# EAGLE schematic Boczek_schm_pls_check (EAGLE 9.6.2)
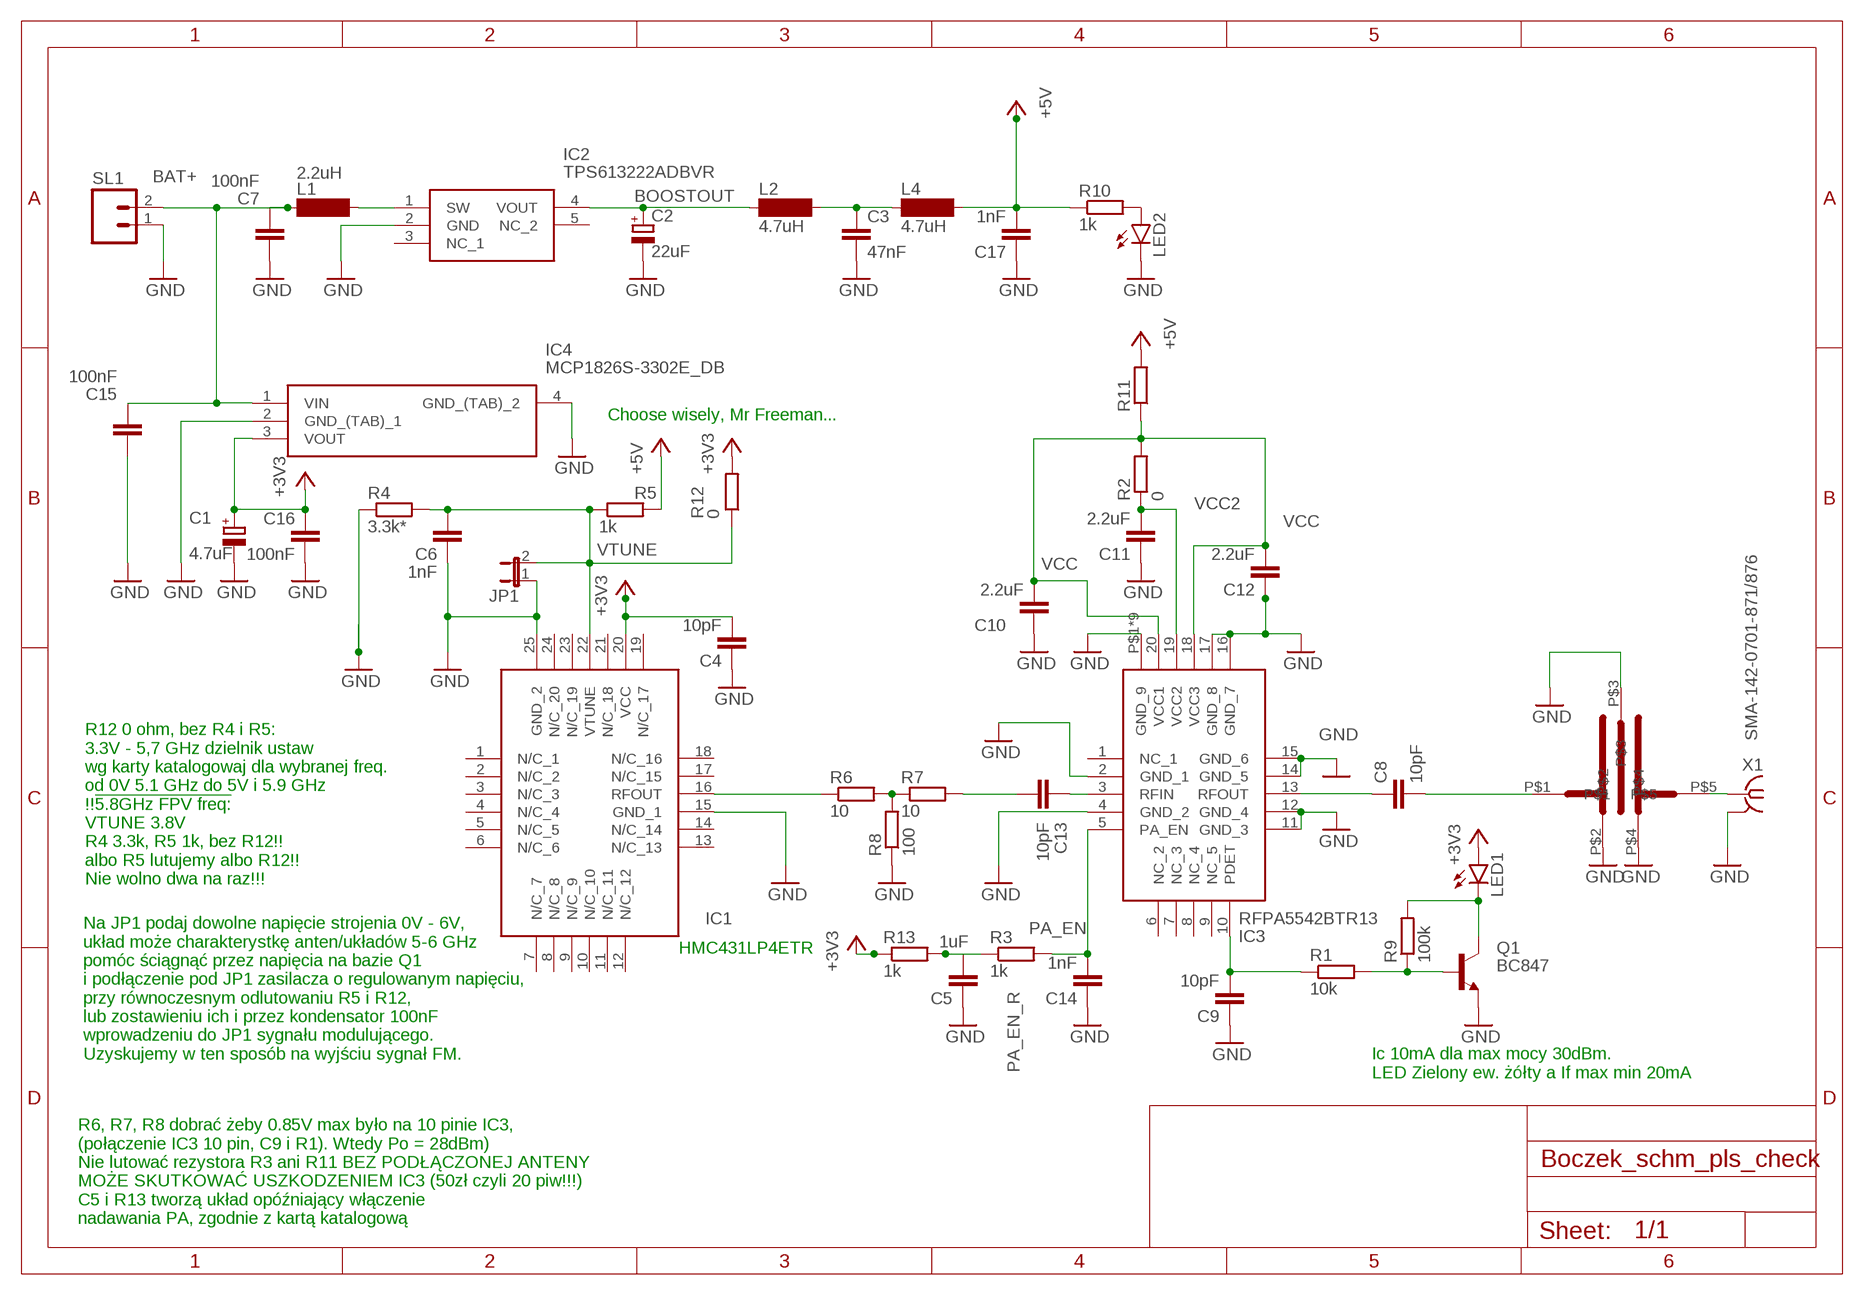
[diagram p0: schematic, sheet 1]

## Parts
C1  4.7uF  CPOL-EUSMCE  [SMC_E]
C2  22uF  CPOL-EUSMCE  [SMC_E]
C3  47nF  C-EUC1206  [C1206]
C4  10pF  C-EUC0603  [C0603]
C5  1uF  C-EUC1206  [C1206]
C6  1nF  C-EUC0402  [C0402]
C7  100nF  C-EUC1206  [C1206]
C8  10pF  C-EUC0402  [C0402]
C9  10pF  C-EUC0402  [C0402]
C10  2.2uF  C-EUC0402  [C0402]
C11  2.2uF  C-EUC0402  [C0402]
C12  2.2uF  C-EUC0402  [C0402]
C13  10pF  C-EUC0402  [C0402]
C14  1nF  C-EUC0402  [C0402]
C15  100nF  C-EUC1206  [C1206]
C16  100nF  C-EUC1206  [C1206]
C17  1nF  C-EUC0402  [C0402]
IC1  HMC430LP4ETR  [QFN50P400X400X100-25N]
IC2  TPS613222ADBVR  [SOT95P280X145-5N]
IC3  RFPA5542BTR13  [QFN50P400X400X85-21N]
IC4  MCP1826S-3302E_DB  [SOT230P700X180-4N]
JP1  JP1E  [JP1]
L1  2.2uH  SM-NE45  [SM-NE45]
L2  4.7uH  SM-NE45  [SM-NE45]
L4  4.7uH  SM-NE45  [SM-NE45]
LED1  LEDSMT1206  [1206]
LED2  LEDSMT1206  [1206]
Q1  BC847  [SOT23]
R1  10k  R-EU_R0603  [R0603]
R2  0  R-EU_R0603  [R0603]
R3  1k  R-EU_R0603  [R0603]
R4  3.3k*  R-EU_R0603  [R0603]
R5  1k  R-EU_R0603  [R0603]
R6  10  R-EU_R0603  [R0603]
R7  10  R-EU_R0603  [R0603]
R8  100  R-EU_R0603  [R0603]
R9  100k  R-EU_R0603  [R0603]
R10  1k  R-EU_R0603  [R0603]
R11  0  R-EU_R0603  [R0603]
R12  0  R-EU_R0603  [R0603]
R13  1k  R-EU_R0603  [R0603]
SL1  M02  [02P]
U$1  INTERDIGITAL_FILTER_3RD_ORDER  [JLC7628_5000_6000_3RDORDER_FILTER]
X1  SMA-142-0701-871/876  [J502-ND-142-0701-871/876]

## Nets
+3V3: C1.+ C4.2 C16.2 IC1.20(VCC) IC4.3(VOUT) LED1.A R12.2 R13.1
+5V: C17.2 L4.2 R5.2 R10.1 R11.2
BAT+: C7.2 C15.2 IC4.1(VIN) L1.1 SL1.2
BOOSTOUT: C2.+ IC2.4(VOUT) L2.1
GND [Gnd]: C1.- C2.- C3.2 C4.1 C5.1 C6.1 C7.1 C9.1 C10.1 C11.1 C12.1 C14.1 C15.1 C16.1 C17.1 IC1.15(GND_1) IC1.25(GND_2) IC2.2(GND) IC3.2(GND_1) IC3.4(GND_2) IC3.11(GND_3) IC3.12(GND_4) IC3.14(GND_5) IC3.15(GND_6) IC3.16(GND_7) IC3.17(GND_8) IC3.P$1(GND_9) IC3.P$2(GND_9) IC3.P$3(GND_9) IC3.P$4(GND_9) IC3.P$5(GND_9) IC3.P$6(GND_9) IC3.P$7(GND_9) IC3.P$8(GND_9) IC3.P$9(GND_9) IC4.2(GND_(TAB)_1) IC4.4(GND_(TAB)_2) JP1.1 LED2.C Q1.2(E) R4.1 R8.1 SL1.1 U$1.P$2 U$1.P$3 U$1.P$4 X1.G@1 X1.G@2 X1.G@3 X1.G@4
N$1: U$1.P$5 X1.1
N$2: IC1.16(RFOUT) R6.1
N$3: R6.2 R7.1 R8.2
N$4: C13.1 IC3.3(RFIN)
N$5: LED2.A R10.2
N$6: C8.2 U$1.P$1
N$7: IC2.1(SW) L1.2
N$8: C13.2 R7.2
N$13: C9.2 IC3.10(PDET) R1.1
N$14: LED1.C Q1.3(C) R9.2
N$15: C3.1 L2.2 L4.1
N$16: Q1.1(B) R1.2 R9.1
N$17: C8.1 IC3.13(RFOUT)
PA_EN: C14.2 IC3.5(PA_EN) R3.2
PA_EN_R: C5.2 R3.1 R13.2
VCC: C10.2 C12.2 IC3.18(VCC3) IC3.20(VCC1) R2.2 R11.1
VCC2: C11.2 IC3.19(VCC2) R2.1
VTUNE: C6.2 IC1.22(VTUNE) JP1.2 R4.2 R5.1 R12.1
Unconnected: IC1.1(N/C_1) IC1.2(N/C_2) IC1.3(N/C_3) IC1.4(N/C_4) IC1.5(N/C_5) IC1.6(N/C_6) IC1.7(N/C_7) IC1.8(N/C_8) IC1.9(N/C_9) IC1.10(N/C_10) IC1.11(N/C_11) IC1.12(N/C_12) IC1.13(N/C_13) IC1.14(N/C_14) IC1.17(N/C_15) IC1.18(N/C_16) IC1.19(N/C_17) IC1.21(N/C_18) IC1.23(N/C_19) IC1.24(N/C_20) IC2.3(NC_1) IC2.5(NC_2) IC3.1(NC_1) IC3.6(NC_2) IC3.7(NC_3) IC3.8(NC_4) IC3.9(NC_5)

## Notes on the sheet
- Choose wisely, Mr Freeman...
- R12 0 ohm, bez R4 i R5:
  3.3V - 5,7 GHz dzielnik ustaw
  wg karty katalogowaj dla wybranej freq.
  od 0V 5.1 GHz do 5V i 5.9 GHz 
  !!!5.8GHz FPV freq:
  VTUNE 3.8V
  R4 3.3k, R5 1k, bez R12!!
  albo R5 lutujemy albo R12!!
  Nie wolno dwa na raz!!!
- HMC431LP4ETR
- Na JP1 podaj dowolne napięcie strojenia 0V - 6V,
  układ może charakterystkę anten/układów 5-6 GHz 
  pomóc ściągnąć przez napięcia na bazie Q1
  i podłączenie pod JP1 zasilacza o regulowanym napięciu,
  przy równoczesnym odlutowaniu R5 i R12,
  lub zostawieniu ich i przez kondensator 100nF
  wprowadzeniu do JP1 sygnału modulującego.
  Uzyskujemy w ten sposób na wyjściu sygnał FM.
- Ic 10mA dla max mocy 30dBm.
  LED Zielony ew. żółty a If max min 20mA
- R6, R7, R8 dobrać żeby 0.85V max było na 10 pinie IC3,
  (połączenie IC3 10 pin, C9 i R1). Wtedy Po = 28dBm)
  Nie lutować rezystora R3 ani R11 BEZ PODŁĄCZONEJ ANTENY
  MOŻE SKUTKOWAĆ USZKODZENIEM IC3 (50zł czyli 20 piw!!!)
  C5 i R13 tworzą układ opóźniający włączenie
  nadawania PA, zgodnie z kartą katalogową

## Library data of the parts
C1 C2 = rcl:CPOL-EU: POLARIZED CAPACITOR, European symbol; SPICEPREFIX: C
C3-C17 = rcl:C-EU: CAPACITOR, European symbol; SPICEPREFIX: C
IC1 = SamacSys_Parts:HMC430LP4ETR: VCO Oscillators VCO SMT w/Buffer amp, 5.0 - 5.5 GHz Source: Datasheet <https://www.analog.com/media/en/technical-documentation/data-sheets/hmc430.pdf>; DESCRIPTION: VCO Oscillators VCO SMT w/Buffer amp, 5.0 - 5.5 GHz; HEIGHT: 1mm; MANUFACTURER_NAME: Analog Devices; MANUFACTURER_PART_NUMBER: HMC431LP4ETR; MOUSER_PART_NUMBER: 584-HMC430LP4ETR; MOUSER_PRICE-STOCK: https://www.mouser.co.uk/ProductDetail/Analog-Devices/HMC430LP4ETR?qs=pceeu5JH%2FH8gg6v6ve1tvQ%3D%3D
IC2 = SamacSys_Parts:TPS613222ADBVR: 6-uA Quiescent Current, 1.8-A Switch Current Boost Converter Source: Datasheet <http://www.ti.com/lit/gpn/tps61322>; DESCRIPTION: 6-uA Quiescent Current, 1.8-A Switch Current Boost Converter; HEIGHT: 1.45mm; MANUFACTURER_NAME: Texas Instruments; MANUFACTURER_PART_NUMBER: TPS613222ADBVR; MOUSER_PART_NUMBER: 595-TPS613222ADBVR; MOUSER_PRICE-STOCK: https://www.mouser.co.uk/ProductDetail/Texas-Instruments/TPS613222ADBVR?qs=W0yvOO0ixfE4d69WXsn8NQ%3D%3D
IC3 = SamacSys_Parts:RFPA5542BTR13: RF Amplifier 5GHZ Discrete PA Source: Datasheet <https://www.mouser.pl/datasheet/2/412/RFPA5542 Data Sheet-1314453.pdf>; DESCRIPTION: RF Amplifier 5GHZ Discrete PA; HEIGHT: 0.85mm; MANUFACTURER_NAME: Qorvo; MANUFACTURER_PART_NUMBER: RFPA5542BTR13; MOUSER_PART_NUMBER: 772-RFPA5542BTR13; MOUSER_PRICE-STOCK: https://www.mouser.co.uk/ProductDetail/Qorvo/RFPA5542BTR13?qs=u4fy%2FsgLU9OIcUWfOD%252Bf6g%3D%3D
IC4 = SamacSys_Parts:MCP1826S-3302E_DB: LDO Regulator 1A 3.3V SOT223-3 MCP1826S-3302E/DB, Low Dropout Voltage Regulator, 1A, 3.3 V +/-2%, 2.3 6 Vin, 4-Pin SOT-223 Source: Datasheet <http://ww1.microchip.com/downloads/en/DeviceDoc/22057B.pdf>; DESCRIPTION: LDO Regulator 1A 3.3V SOT223-3 MCP1826S-3302E/DB, Low Dropout Voltage Regulator, 1A, 3.3 V +/-2%, 2.3 6 Vin, 4-Pin SOT-223; HEIGHT: 1.8mm; MANUFACTURER_NAME: Microchip; MANUFACTURER_PART_NUMBER: MCP1826S-3302E/DB; MOUSER_PART_NUMBER: 579-MCP1826S-3302EDB; MOUSER_PRICE-STOCK: https://www.mouser.co.uk/ProductDetail/Microchip-Technology-Atmel/MCP1826S-3302E-DB?qs=gsqZ4L1luKqjUo%2Fe%2Fgllfg%3D%3D
JP1 = jumper:JP1E: JUMPER
L1 L4 = inductor-neosid:SM-NE45: INDUCTOR SMD chip inductor; OC_FARNELL: unknown; OC_NEWARK: unknown
L2 = inductor-neosid:SM-NE45: INDUCTOR SMD chip inductor; OC_FARNELL: unknown; OC_NEWARK: unknown; SPICEPREFIX: L
LED1 LED2 = led:LED: LED OSRAM: - CHIPLED LG R971, LG N971, LY N971, LG Q971, LY Q971, LO R971, LY R971 LH N974, LH R974 LS Q976, LO Q976, LY Q976 LO Q996 - Hyper CHIPLED LW Q18S LB Q993, LB Q99A, LB R99A - SideLED LS A670, LO A670, LY A670, LG A670, LP A670 LB A673, LV A673, LT A673, LW A673 LH A674 LY A675 LS A676, LA A676, LO A676, LY A676, LW A676 LS A679, LY A679, LG A679 - Hyper Micro SIDELED® LS Y876, LA Y876, LO Y876, LY Y876 LT Y87S - SmartLED LW L88C, LW L88S LB L89C, LB L89S, LG L890 LS L89K, LO L89K, LY L89K LS L896, LA L896, LO L896, LY L896 - TOPLED LS T670, LO T670, LY T670, LG T670, LP T670 LSG T670, LSP T670, LSY T670, LOP T670, LYG T670 LG T671, LOG T671, LSG T671 LB T673, LV T673, LT T673, LW T673 LH T674 LS T676, LA T676, LO T676, LY T676, LB T676, LH T676, LSB T676, LW T676 LB T67C, LV T67C, LT T67C, LS T67K, LO T67K, LY T67K, LW E67C LS E67B, LA E67B, LO E67B, LY E67B, LB E67C, LV E67C, LT E67C LW T67C LS T679, LY T679, LG T679 LS T770, LO T770, LY T770, LG T770, LP T770 LB T773, LV T773, LT T773, LW T773 LH T774 LS E675, LA E675, LY E675, LS T675 LS T776, LA T776, LO T776, LY T776, LB T776 LHGB T686 LT T68C, LB T68C - Hyper Mini TOPLED® LB M676 - Mini TOPLED Santana® LG M470 LS M47K, LO M47K, LY M47K Source: http://www.osram.convergy.de LUXEON: - LUMILED® LXK2-PW12-R00, LXK2-PW12-S00, LXK2-PW14-U00, LXK2-PW14-V00 LXK2-PM12-R00, LXK2-PM12-S00, LXK2-PM14-U00 LXK2-PE12-Q00, LXK2-PE12-R00, LXK2-PE12-S00, LXK2-PE14-T00, LXK2-PE14-U00 LXK2-PB12-K00, LXK2-PB12-L00, LXK2-PB12-M00, LXK2-PB14-N00, LXK2-PB14-P00, LXK2-PB14-Q00 LXK2-PR12-L00, LXK2-PR12-M00, LXK2-PR14-Q00, LXK2-PR14-R00 LXK2-PD12-Q00, LXK2-PD12-R00, LXK2-PD12-S00 LXK2-PH12-R00, LXK2-PH12-S00 LXK2-PL12-P00, LXK2-PL12-Q00, LXK2-PL12-R00 Source: www.luxeon.com KINGBRIGHT: KA-3528ASYC Source: www.kingbright.com
Q1 = transistor:BC847: NPN TRANSISTOR
R1-R3 R10-R13 = rcl:R-EU_: RESISTOR, European symbol; SPICEPREFIX: R
R4-R9 = resistor:R-EU_: RESISTOR, European symbol
SL1 = con-amp-quick:M02: AMP QUICK CONNECTOR; OC_FARNELL: unknown; OC_NEWARK: unknown
U$1 = Alex_RF:INTERDIGITAL_FILTER_3RD_ORDER: JLC04161H-7628 Stackup 0,2104 mm pod filtrem warstwa GND 2mm od filtra na wartstwie TOP odległości od ground plane
X1 = con-coax:SMA-: SMA 50 Ohm End Launch Jack Receptacle - Round Contact Johnson Components Source: www.johnsoncomponents.com .. J502-ND.pdf; MF: JOHNSON COMPONENTS; MPN: 142-0701-871; OC_FARNELL: 1339835; OC_NEWARK: 91B6105